# Altium schematic sheet Programming Connector.SchDoc
size A4
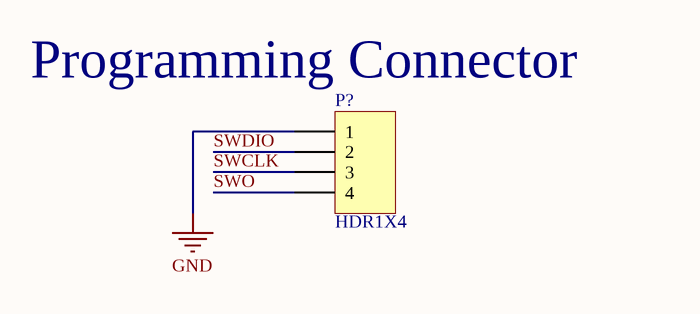
[diagram p0: Programming Connector.SchDoc]

## Parts
P?  HDR1X4  [Molex SPOX Horizontal 4 Circuits]

## Nets
GND: P?.1
SWCLK: P?.3
SWDIO: P?.2
SWO: P?.4

## Notes on the sheet
- (near P?) Programming Connector

## Library data of the parts
P? = HDR1X4: Header, 4-Pin; LatestRevisionDate: 17-Jul-2002; LatestRevisionNote: Re-released for DXP Platform.; Publisher: Altium Limited